# EasyEDA schematic skematikEasyEDA.json
TITLE: Sheet_1; REV: 1.0; Date: 2026-05-16; Sheet: 1/1; Drawn By: zerovoltacademy; Company: Your Company
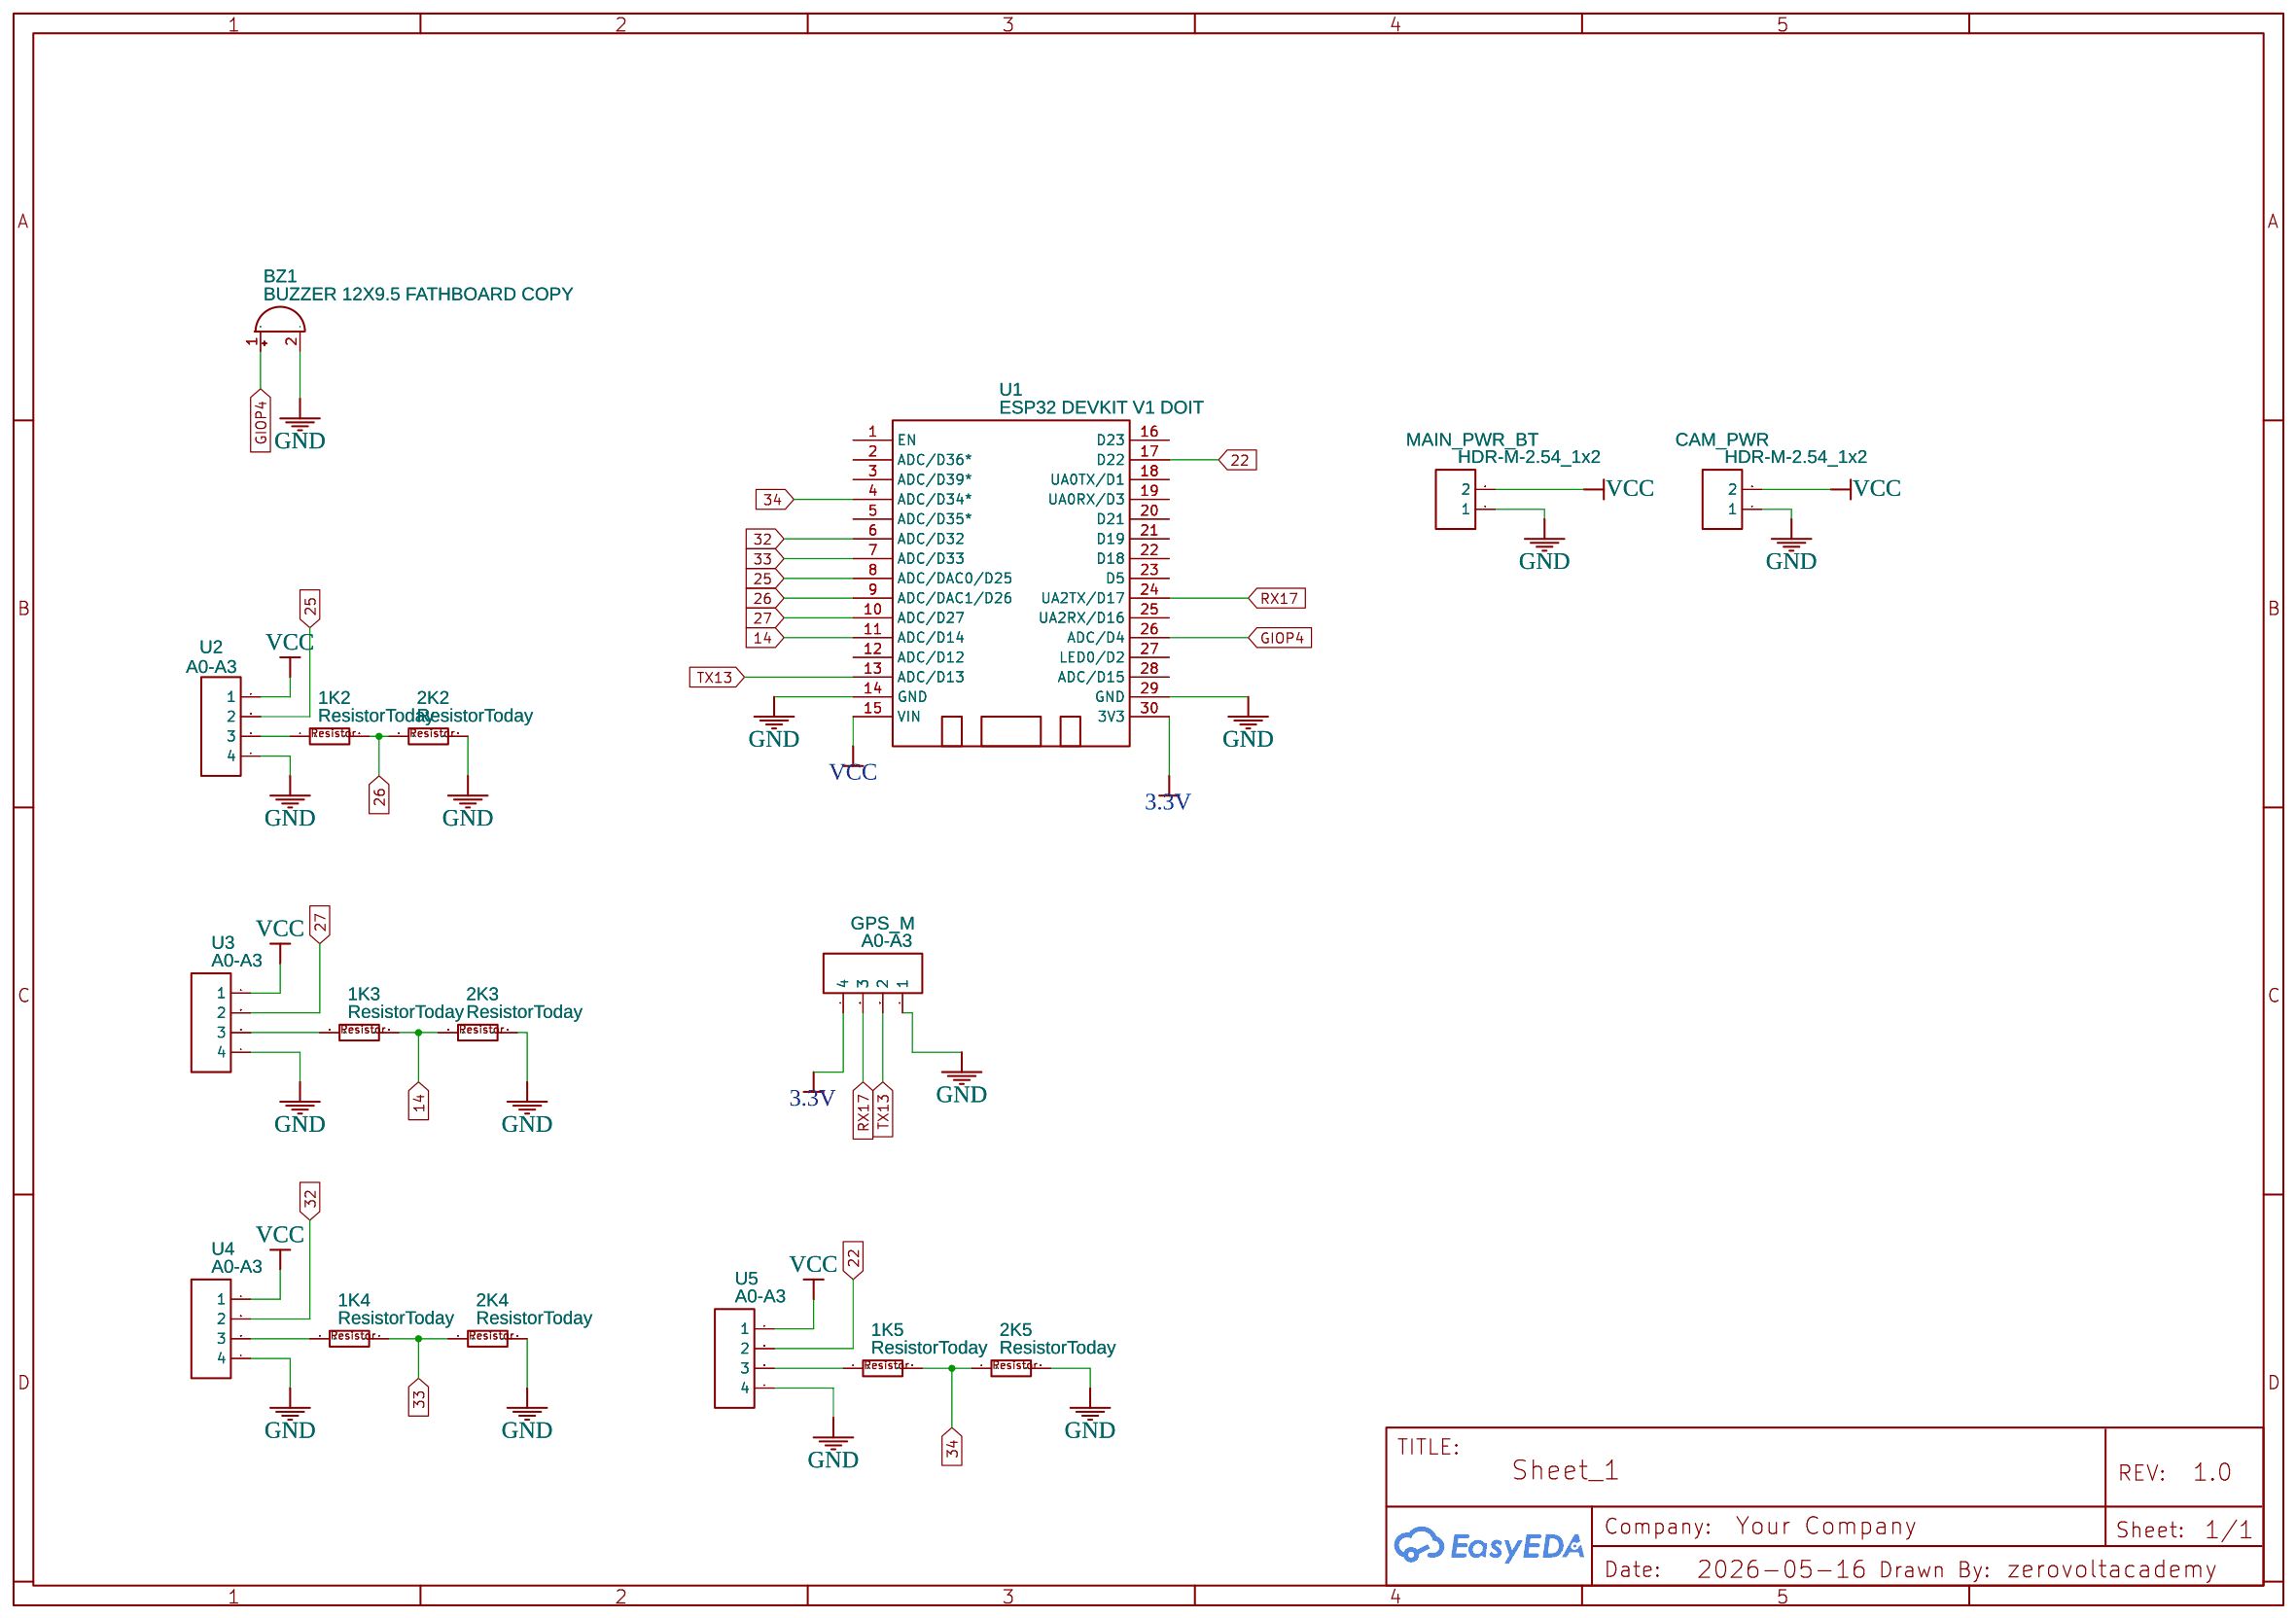
[diagram p0: schematic sheet]

## Parts
1K2  ResistorToday  [AXIAL-0.6]
1K3  ResistorToday  [AXIAL-0.6]
1K4  ResistorToday  [AXIAL-0.6]
1K5  ResistorToday  [AXIAL-0.6]
2K2  ResistorToday  [AXIAL-0.6]
2K3  ResistorToday  [AXIAL-0.6]
2K4  ResistorToday  [AXIAL-0.6]
2K5  ResistorToday  [AXIAL-0.6]
BZ1  BUZZER 12X9.5 FATHBOARD COPY  [BUZZER_BEEPER:BUZZER_12X9.5RM7.6]
CAM_PWR  HDR-M-2.54_1x2  [HDR-M-2.54_1X2]
GPS_M  A0-A3  [CONNECTOR_PINHEADER_2.54MM:PINHEADER_1X4]
MAIN_PWR_BT  HDR-M-2.54_1x2  [HDR-M-2.54_1X2]
U1  ESP32 DEVKIT V1 DOIT  [DOIT-ESP32-DEVKIT-V1]
U2  A0-A3  [CONNECTOR_PINHEADER_2.54MM:PINHEADER_1X4]
U3  A0-A3  [CONNECTOR_PINHEADER_2.54MM:PINHEADER_1X4]
U4  A0-A3  [CONNECTOR_PINHEADER_2.54MM:PINHEADER_1X4]
U5  A0-A3  [CONNECTOR_PINHEADER_2.54MM:PINHEADER_1X4]

## Library data of the parts
1K2-1K5 2K2-2K5 = RESISTOR COPY: Supplier: LCSC; Supplier Part: C348838; Manufacturer Part: EWWR0001J20R0T9; Contributor: robosnake26
BZ1 = BUZZER 12X9.5 FATHBOARD COPY: Symbol: Device_Buzzer; Device: Device_Buzzer; Add into BOM: yes; Convert to PCB: yes; Origin Footprint: Buzzer_Beeper:Buzzer_12x9.5RM7.6; Contributor: t.teenoom
CAM_PWR MAIN_PWR_BT = HDR-M-2.54_1x2: Supplier Part: C124375; Supplier: LCSC; Contributor: mbeverly
GPS_M U2-U5 = HEADER PAD 2X: Supplier: LCSC; Manufacturer: BOOMELE; Manufacturer Part: Female headerHDR1X8-2.54; Supplier Part: C27438; JLCPCB Part Class: Extended Part; Contributor: inovsilversky
U1 = ESP32 DEVKIT V1 DOIT: Contributor: jonas.vindahl

## Nets
3.3V: GPS_M.4 U1.30(3V3)
GND: 2K2.2 2K3.2 2K4.2 2K5.2 BZ1.2(-) CAM_PWR.1 GPS_M.1 MAIN_PWR_BT.1 U1.14(GND) U1.29(GND) U2.4 U3.4 U4.4 U5.4
VCC: CAM_PWR.2 MAIN_PWR_BT.2 U1.15(VIN) U2.1 U3.1 U4.1 U5.1
14: 1K3.2 2K3.1 U1.11(ADC/D14)
22: U1.17(D22) U5.2
25: U1.8(ADC/DAC0/D25) U2.2
26: 1K2.2 2K2.1 U1.9(ADC/DAC1/D26)
27: U1.10(ADC/D27) U3.2
32: U1.6(ADC/D32) U4.2
33: 1K4.2 2K4.1 U1.7(ADC/D33)
34: 1K5.2 2K5.1 U1.4(ADC/D34*)
GIOP4: BZ1.1(+) U1.26(ADC/D4)
RX17: GPS_M.3 U1.24(UA2TX/D17)
TX13: GPS_M.2 U1.13(ADC/D13)
Net-(1K2-1): 1K2.1 U2.3
Net-(1K3-1): 1K3.1 U3.3
Net-(1K4-1): 1K4.1 U4.3
Net-(1K5-1): 1K5.1 U5.3

Not connected (* = marked no-connect by the designer): U1 1(EN) 2(ADC/D36*) 3(ADC/D39*) 5(ADC/D35*) 12(ADC/D12) 16(D23) 18(UA0TX/D1) 19(UA0RX/D3) 20(D21) 21(D19) 22(D18) 23(D5) 25(UA2RX/D16) 27(LED0/D2) 28(ADC/D15)
